# EAGLE design L298213 (EAGLE 7.6.0)
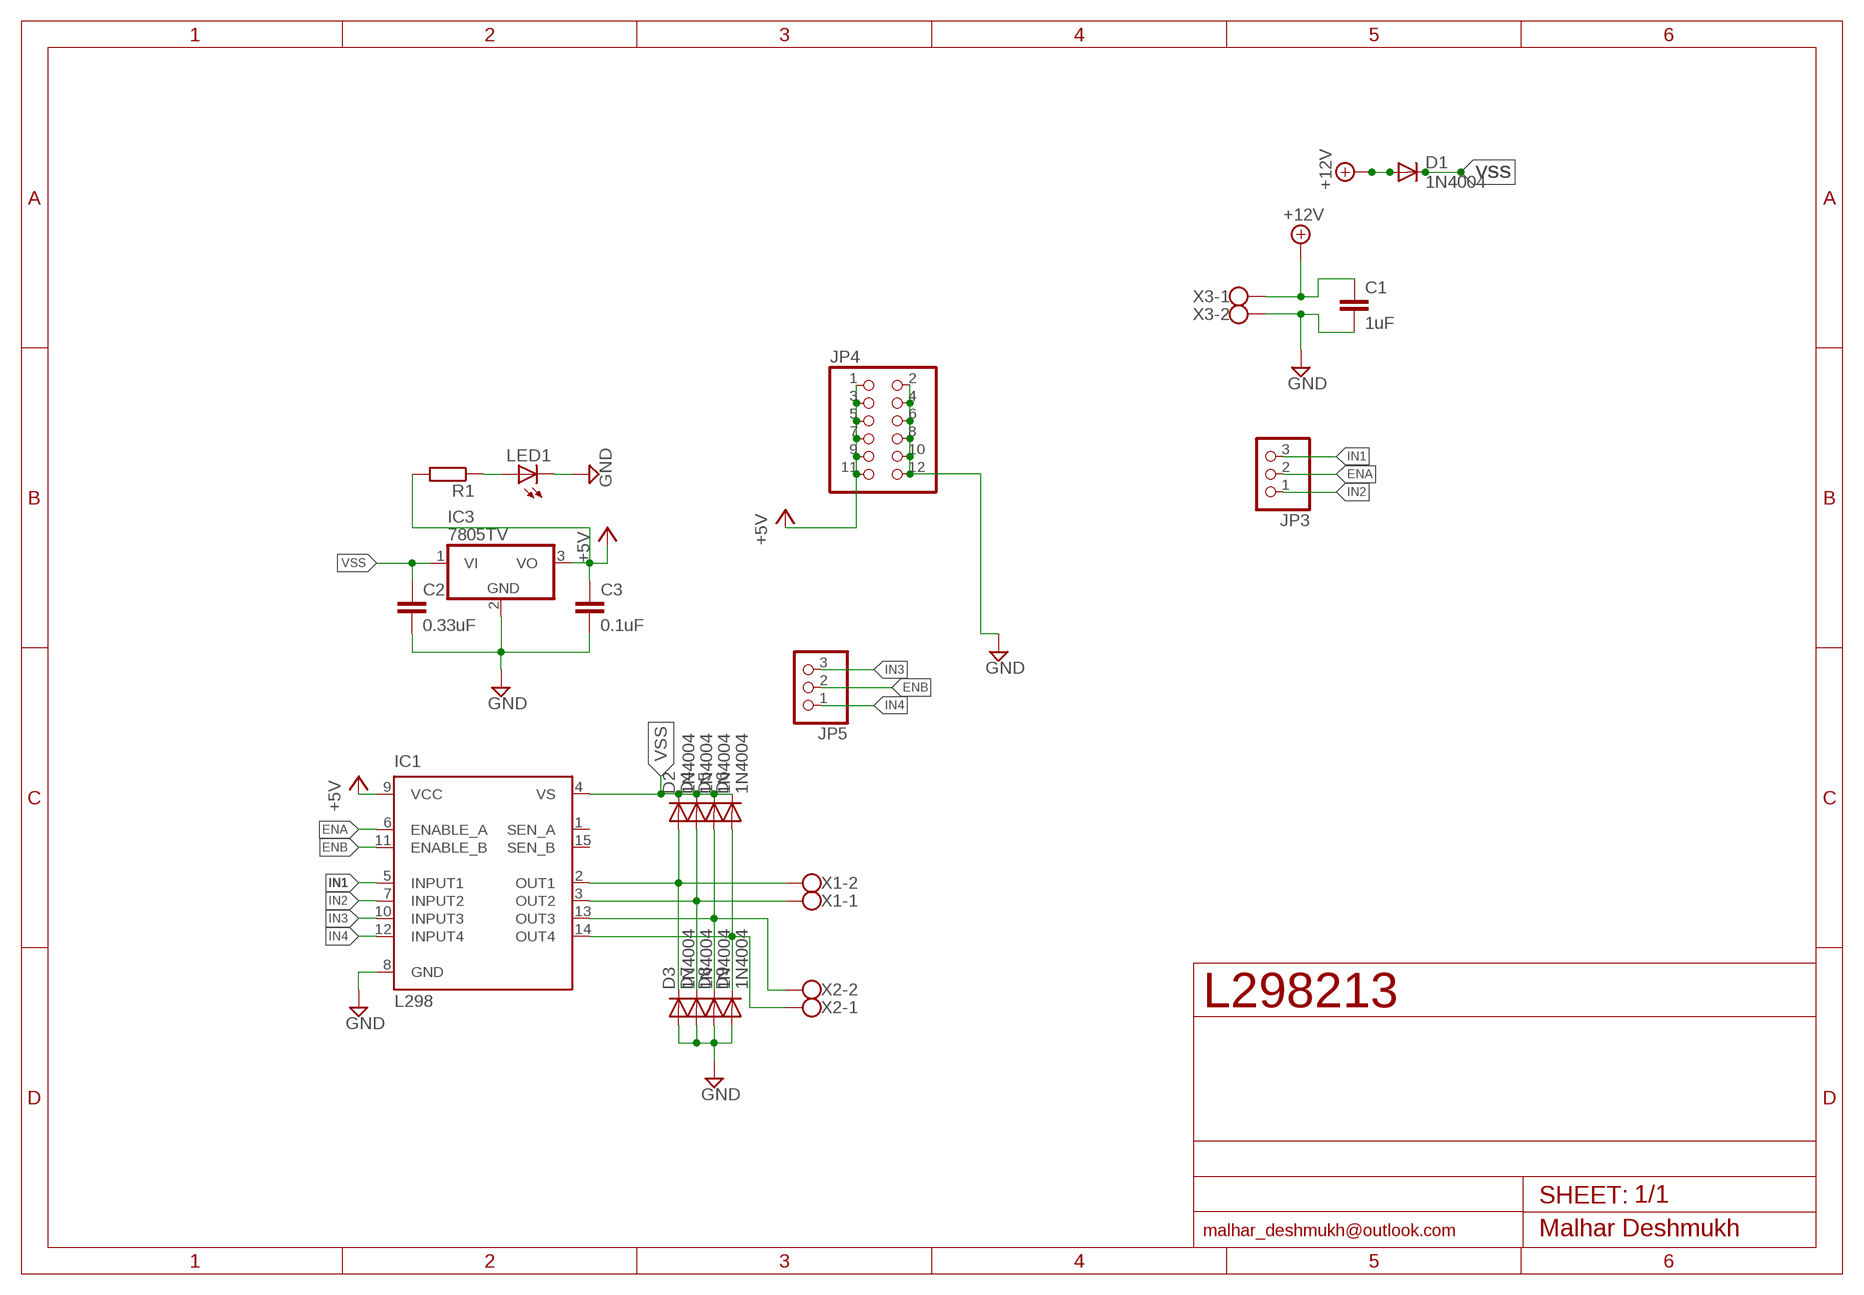
[diagram p0: schematic, sheet 1]

## Parts
C1  1uF  C-EU050-024X044  [C050-024X044]
C2  0.33uF  C-EU050-024X044  [C050-024X044]
C3  0.1uF  C-EU050-024X044  [C050-024X044]
D1  1N4004  [DO41-10]
D2  1N4004  [DO41-10]
D3  1N4004  [DO41-10]
D4  1N4004  [DO41-10]
D5  1N4004  [DO41-10]
D6  1N4004  [DO41-10]
D7  1N4004  [DO41-10]
D8  1N4004  [DO41-10]
D9  1N4004  [DO41-10]
IC1  L298  [MULTIWATT-15]
IC3  7805TV  [TO220V]
JP3  PINHD-1X3  [1X03]
JP4  PINHD-2X6  [2X06]
JP5  PINHD-1X3  [1X03]
LED1  LED3MM  [LED3MM]
R1  R-EU_0207/5V  [0207/5V]
X1  W237-102  [W237-102]
X2  W237-102  [W237-102]
X3  W237-102  [W237-102]

## Nets
+5V: C3.1 IC1.9(VCC) IC3.3(VO) JP4.1 JP4.3 JP4.5 JP4.7 JP4.9 JP4.11 R1.2
+12V: C1.1 D1.A X3.1
ENA: IC1.6(ENABLE_A) JP3.2
ENB: IC1.11(ENABLE_B) JP5.2
GND: C1.2 C2.2 C3.2 D3.A D7.A D8.A D9.A IC1.8(GND) IC3.2(GND) JP4.2 JP4.4 JP4.6 JP4.8 JP4.10 JP4.12 LED1.K(C) X3.2
IN1: IC1.5(INPUT1) JP3.3
IN2: IC1.7(INPUT2) JP3.1
IN3: IC1.10(INPUT3) JP5.3
IN4: IC1.12(INPUT4) JP5.1
N$1: D2.A D3.C IC1.2(OUT1) X1.2
N$2: D4.A D7.C IC1.3(OUT2) X1.1
N$3: D5.A D8.C IC1.13(OUT3) X2.2
N$4: D6.A D9.C IC1.14(OUT4) X2.1
N$5: LED1.A R1.1
VSS: C2.1 D1.C D2.C D4.C D5.C D6.C IC1.4(VS) IC3.1(VI)
Unconnected: IC1.1(SEN_A) IC1.15(SEN_B)

## Library data of the parts
C1-C3 = resistor:C-EU: CAPACITOR, European symbol
D1-D9 = adafruit:1N4004: DIODE General purpose 1N400x type rectifier (With bigger pads) http://www.ladyada.net/library/pcb/eaglelibrary.html
IC1 = st-microelectronics:L298: DUAL FULL-BRIDGE DRIVER; MPN: L298N; OC_FARNELL: 1589425; OC_NEWARK: 32M1527
IC3 = linear:78*: Positive VOLTAGE REGULATOR Source: http://cache.national.com/ds/LM/LM78L05.pdf http://www.fairchildsemi.com/ds/LM/LM7805.pdf
JP3 JP5 = pinhead:PINHD-1X3: PIN HEADER
JP4 = pinhead:PINHD-2X6: PIN HEADER
LED1 = led:LED: LED OSRAM: - CHIPLED LG R971, LG N971, LY N971, LG Q971, LY Q971, LO R971, LY R971 LH N974, LH R974 LS Q976, LO Q976, LY Q976 LO Q996 - Hyper CHIPLED LW Q18S LB Q993, LB Q99A, LB R99A - SideLED LS A670, LO A670, LY A670, LG A670, LP A670 LB A673, LV A673, LT A673, LW A673 LH A674 LY A675 LS A676, LA A676, LO A676, LY A676, LW A676 LS A679, LY A679, LG A679 - Hyper Micro SIDELED® LS Y876, LA Y876, LO Y876, LY Y876 LT Y87S - SmartLED LW L88C, LW L88S LB L89C, LB L89S, LG L890 LS L89K, LO L89K, LY L89K LS L896, LA L896, LO L896, LY L896 - TOPLED LS T670, LO T670, LY T670, LG T670, LP T670 LSG T670, LSP T670, LSY T670, LOP T670, LYG T670 LG T671, LOG T671, LSG T671 LB T673, LV T673, LT T673, LW T673 LH T674 LS T676, LA T676, LO T676, LY T676, LB T676, LH T676, LSB T676, LW T676 LB T67C, LV T67C, LT T67C, LS T67K, LO T67K, LY T67K, LW E67C LS E67B, LA E67B, LO E67B, LY E67B, LB E67C, LV E67C, LT E67C LW T67C LS T679, LY T679, LG T679 LS T770, LO T770, LY T770, LG T770, LP T770 LB T773, LV T773, LT T773, LW T773 LH T774 LS E675, LA E675, LY E675, LS T675 LS T776, LA T776, LO T776, LY T776, LB T776 LHGB T686 LT T68C, LB T68C - Hyper Mini TOPLED® LB M676 - Mini TOPLED Santana® LG M470 LS M47K, LO M47K, LY M47K Source: http://www.osram.convergy.de LUXEON: - LUMILED® LXK2-PW12-R00, LXK2-PW12-S00, LXK2-PW14-U00, LXK2-PW14-V00 LXK2-PM12-R00, LXK2-PM12-S00, LXK2-PM14-U00 LXK2-PE12-Q00, LXK2-PE12-R00, LXK2-PE12-S00, LXK2-PE14-T00, LXK2-PE14-U00 LXK2-PB12-K00, LXK2-PB12-L00, LXK2-PB12-M00, LXK2-PB14-N00, LXK2-PB14-P00, LXK2-PB14-Q00 LXK2-PR12-L00, LXK2-PR12-M00, LXK2-PR14-Q00, LXK2-PR14-R00 LXK2-PD12-Q00, LXK2-PD12-R00, LXK2-PD12-S00 LXK2-PH12-R00, LXK2-PH12-S00 LXK2-PL12-P00, LXK2-PL12-Q00, LXK2-PL12-R00 Source: www.luxeon.com KINGBRIGHT: KA-3528ASYC Source: www.kingbright.com
R1 = resistor:R-EU_: RESISTOR, European symbol
X1-X3 = con-wago-500:W237-102: WAGO SCREW CLAMP; MPN: 237-102; OC_FARNELL: unknown; OC_NEWARK: 70K9898

## Board
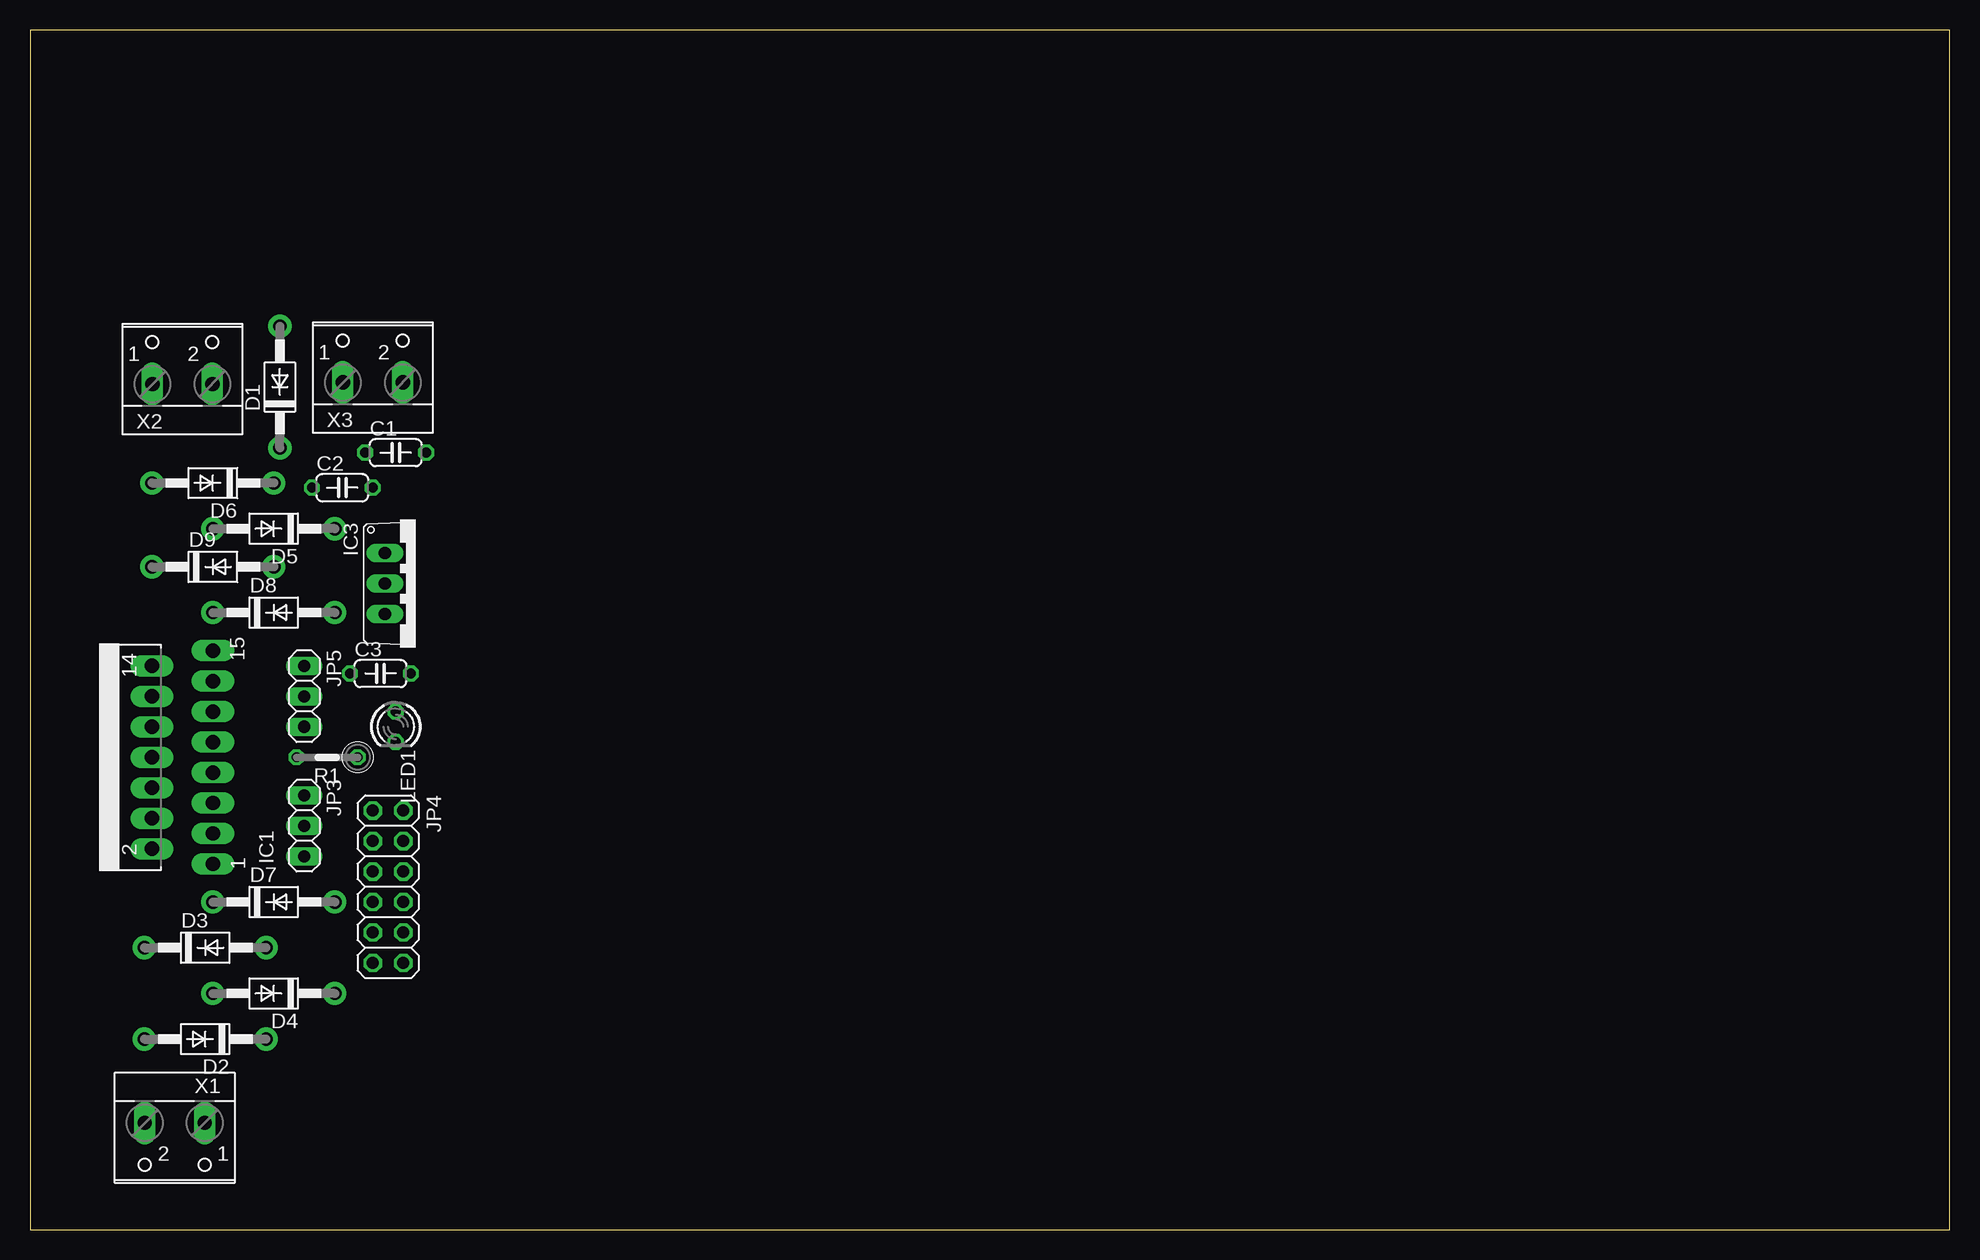
[diagram p1: board, top side]
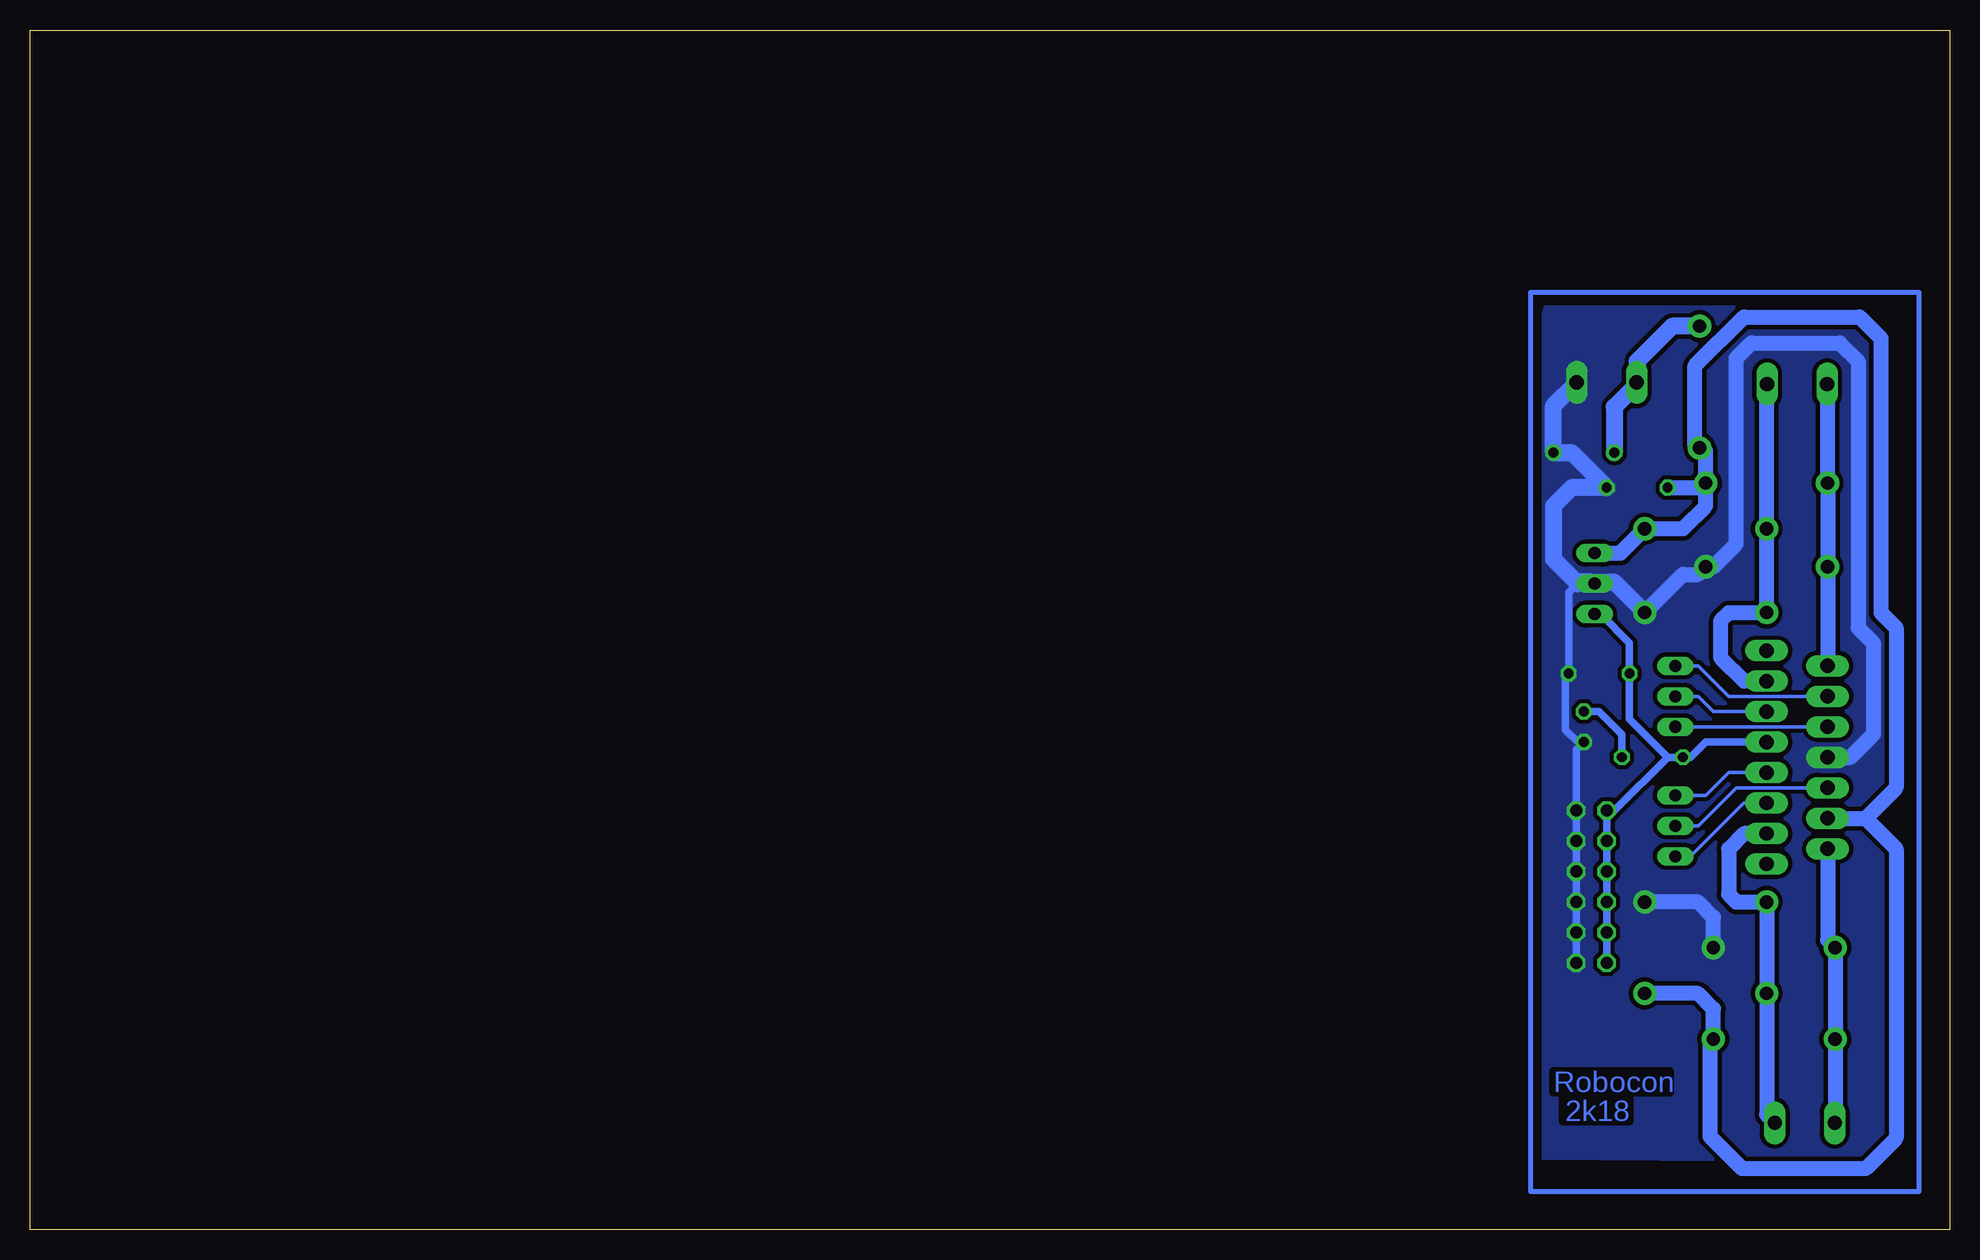
[diagram p2: board, bottom side, seen from below]

Size 160 x 100 mm. Coordinates in mm from the lower left corner, seen from the top.
Outline: 0,0 160,0 160,100 0,100 0,0
Copper layers (1*16): Top 0.035mm / dielectric 1.5mm / Bottom 0.035mm
Design rules "default": minimum track width 10mil, minimum drill 24mil, track to track 8mil, track to pad 8mil, pad to pad 8mil, via to via 8mil, smd to smd 8mil, copper to edge 40mil, drill to drill 8mil, minimum pad ring 10mil, minimum via ring 8mil, stop-mask expansion 4mil, vias tented up to drill 0mil, thermal gap 10mil

### Footprints (pad centres in the part's own frame; a part is rotated, then mirrored left to right if it is on the bottom)
C050-024X044 = drill 0.813 octagon: 1 -2.54,0; 2 2.54,0
DO41-10 = drill 1.118 pad 1.93: A 5.08,0; C -5.08,0
MULTIWATT-15 = drill 1.2 long: 1 -8.89,-7.62; 2 -7.62,-2.54; 3 -6.35,-7.62; 4 -5.08,-2.54; 5 -3.81,-7.62; 6 -2.54,-2.54; 7 -1.27,-7.62; 8 0,-2.54; 9 1.27,-7.62; 10 2.54,-2.54; 11 3.81,-7.62; 12 5.08,-2.54; 13 6.35,-7.62; 14 7.62,-2.54; 15 8.89,-7.62
TO220V = drill 1.016 long: 1 -2.54,-2.54; 2 0,-2.54; 3 2.54,-2.54
1X03 = drill 1.016 long: 1 -2.54,0; 2 0,0; 3 2.54,0
2X06 = drill 1.016 octagon: 1 -6.35,-1.27; 2 -6.35,1.27; 3 -3.81,-1.27; 4 -3.81,1.27; 5 -1.27,-1.27; 6 -1.27,1.27; 7 1.27,-1.27; 8 1.27,1.27; 9 3.81,-1.27; 10 3.81,1.27; 11 6.35,-1.27; 12 6.35,1.27
LED3MM = drill 0.813 octagon: A -1.27,0; K 1.27,0
0207/5V = drill 0.813 octagon: 1 -2.54,0; 2 2.54,0
W237-102 = drill 1.194 long: 1 -2.5,-1.27; 2 2.5,-1.27

### Placement (x,y rotation side)
C1  30.48,64.77 0 top
C2  26.04,61.85 0 top
C3  29.21,46.35 0 top
D1  20.83,70.23 90 top
D2  14.61,15.88 180 top
D3  14.61,23.5 0 top
D4  20.32,19.68 180 top
D5  20.32,58.42 180 top
D6  15.24,62.23 180 top
D7  20.32,27.3 0 top
D8  20.32,51.44 0 top
D9  15.24,55.24 0 top
IC1  7.62,39.37 90 top
IC3  32.13,53.85 270 top
JP3  22.86,33.66 270 top
JP4  29.84,28.57 270 top
JP5  22.86,44.45 270 top
LED1  30.48,41.91 270 top
R1  24.77,39.37 180 top
X1  12.06,7.62 180 top
X2  12.7,71.75 0 top
X3  28.57,71.88 0 top

### Tracks (layer width: path | path; a pad name or v marks a point on that pad's centre or on a via)
+5V
  Bottom 0.61: IC3.3 29.08,51.31 26.67,48.9 C3.1 26.67,42.55 23.5,39.37 | IC1.9 20.32,40.64 21.59,39.37 R1.2 23.5,39.37 | 23.5,39.37 27.94,34.92 JP4.1 JP4.3 JP4.5 JP4.7 JP4.9 JP4.11
+12V
  Bottom 1.422: D1.A 23.11,75.31 26.04,72.39 26.04,70.65 X3.1 26.07,70.44 27.94,68.58 C1.1
ENA
  Bottom 0.305: IC1.6 17.78,36.83 20.95,33.66 JP3.2
ENB
  Bottom 0.305: IC1.11 19.68,43.18 20.95,44.45 JP5.2
GND
  Bottom 0.61: IC3.2 30.99,53.85 31.75,53.09 C3.2 32,46.1 32,41.66 30.99,40.64 LED1.K 31.11,40.01 JP4.2 JP4.4 JP4.6 JP4.10 JP4.12
  Bottom 1.27: D3.A 19.68,26.04 20.95,27.3 D7.A | D8.A 22.23,54.61 20.95,54.61 D9.A 19.68,55.24 17.78,57.15 17.78,72.64 16.51,73.91 9.14,73.91 7.62,72.39 7.62,50.16 6.35,48.9 6.35,41.27 8.26,39.37 IC1.8
  Bottom 1.422: X3.2 33.02,68.67 C1.2 31.5,64.77 C2.2 31.5,61.85 33.02,60.33 33.02,55.88 31.11,53.98 | 31.11,53.98 30.99,53.85 | IC3.2 29.72,53.85 29.84,53.98 | 29.84,53.98 31.11,53.98 | 29.84,53.98 27.94,53.98 D8.A
  pour Bottom (isolate 0.356, no thermals): 5.08,5.71 33.78,5.97 33.78,76.45 33.66,76.2 33.66,76.83 5.08,76.83
IN1
  Bottom 0.305: IC1.5 17.14,35.56 21.59,31.11 JP3.3
IN2
  Bottom 0.305: IC1.7 18.41,38.1 20.32,36.2 JP3.1
IN3
  Bottom 0.305: IC1.10 JP5.3
IN4
  Bottom 0.305: IC1.12 18.41,44.45 20.95,46.99 JP5.1
N$1
  Bottom 1.27: IC1.2 10.16,24.13 D3.C D2.A 9.53,8.93 X1.2
N$2
  Bottom 1.27: IC1.3 17.14,33.02 18.41,31.75 18.41,27.94 17.78,27.3 D7.C D4.A 15.24,9.56 X1.1
N$3
  Bottom 1.27: IC1.13 17.14,45.72 19.05,47.62 19.05,50.8 18.41,51.44 D8.C D5.A 15.24,70.44 X2.2
N$4
  Bottom 1.27: X2.1 10.2,62.27 D6.A D9.C IC1.14
N$5
  Bottom 0.61: LED1.A 29.21,43.18 27.3,41.27 R1.1
N$6
  Bottom 0.406: 2.54,3.17 2.54,78.11 34.92,78.11 34.92,3.17 2.54,3.17
VSS
  Bottom 1.27: D6.C 20.32,60.33 22.23,58.42 D5.C 27.43,56.39 IC3.1 | D4.C 20.95,19.68 19.68,18.41 D2.C 19.94,15.62 19.94,7.75 17.27,5.08 6.99,5.08 4.45,7.62 4.45,31.75 6.99,34.29 | D6.C 20.32,64.64 D1.C | C2.1 20.7,61.85 D6.C | D6.C 20.32,64.9 20.83,64.9 21.21,65.28 21.21,72.01 17.14,76.07 7.49,76.07 5.71,74.3 5.71,51.44 4.45,50.16 4.45,36.83 6.99,34.29 | IC1.4 6.99,34.29

### Text on the board
Bottom: 2k18 | Robocon